# Altium project Soldeerbout_V2.PrjPcb
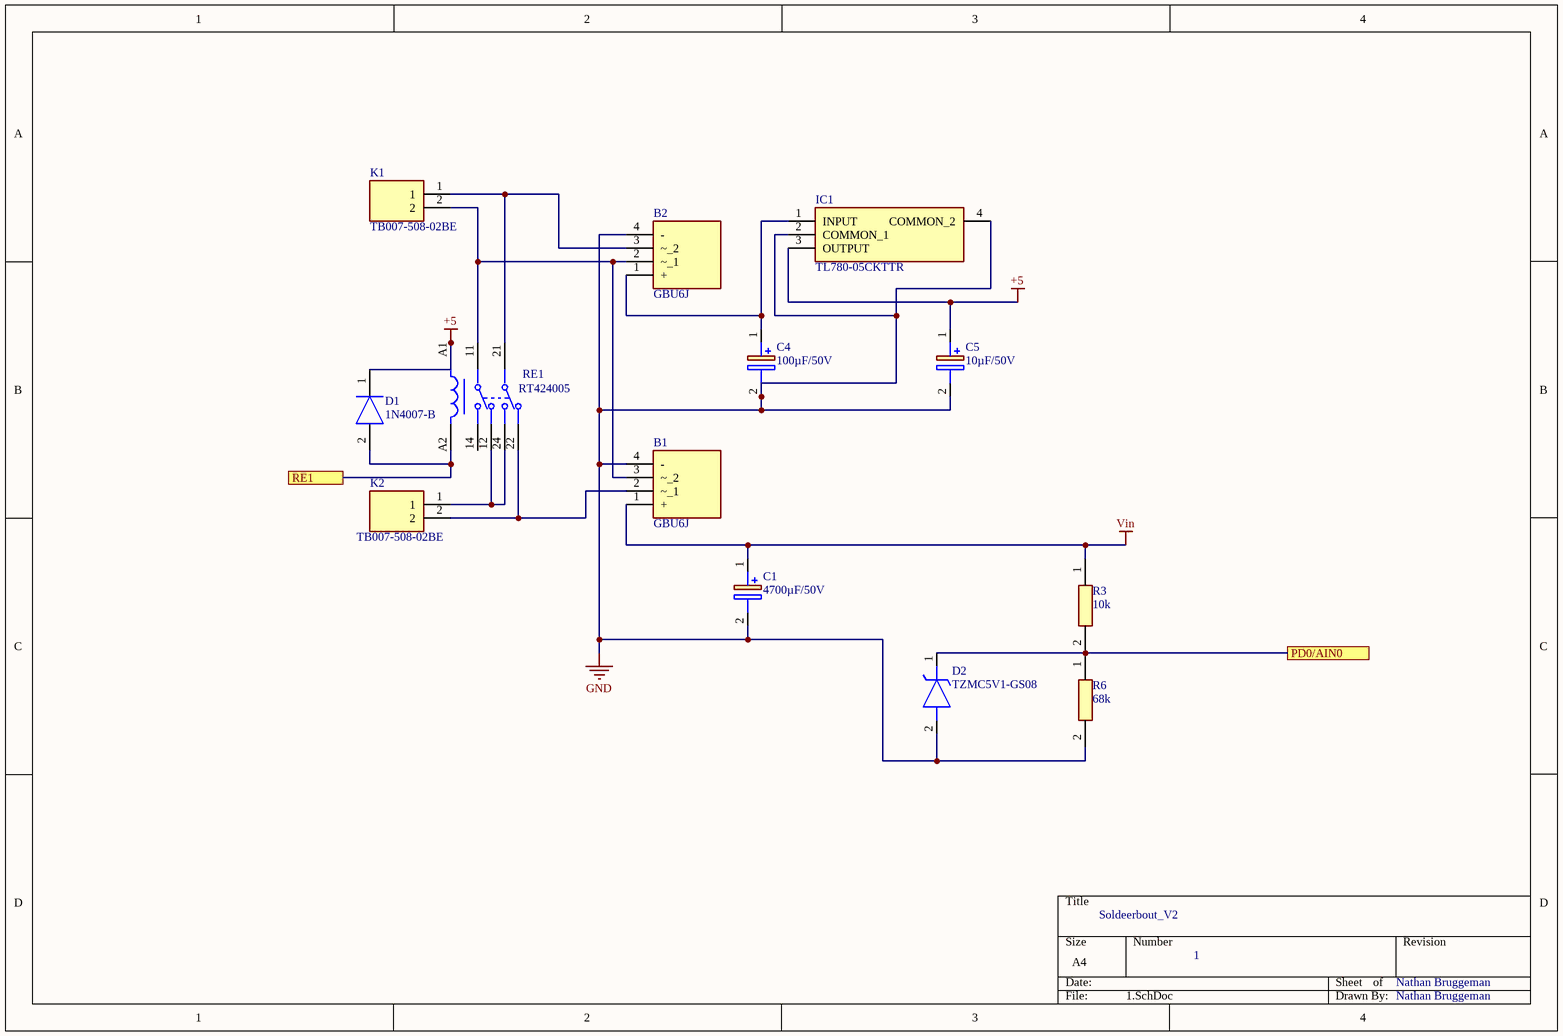
[diagram p0: 1.SchDoc]
4 sheets, 55 parts. Net scope: flat (ports and power ports of the same name join across sheets).
Board file: PCB1.PcbDoc
Sheets:
  1.SchDoc
  2.SchDoc
  3.SchDoc
  6.SchDoc

## Sheet 1.SchDoc
size A4; SheetNumber: 1; SheetTotal: 5

### Parts
B1  GBU6J  [GBU6J]
B2  GBU6J  [GBU6J]
C1  4700µF/50V  [CAPPRD1000W80D2200H3700]
C4  100µF/50V  [CAPPRD350W60D800H1250]
C5  10µF/50V  [CAPPRD200W55D500H1200]
D1  1N4007-B  [DIOAD1410W90L470D235]
D2  TZMC5V1-GS08  [TZMC5V1GS08]
IC1  TL780-05CKTTR  [TL78005CKTTR]
K1  TB007-508-02BE  [TB00750802BE]
K2  TB007-508-02BE  [TB00750802BE]
R3  10k  [0805]
R6  68k  [0805]
RE1  RT424005  [FP-RT424005-MFG]

### Ports
PD0/AIN0, RE1

### Nets
+5: C5.1(+) D1.1(K) IC1.3(OUTPUT) RE1.A1
GND: B1.4(-) B2.4(-) C1.2(-) C4.2(-) C5.2(-) D2.2(A) IC1.2(COMMON_1) IC1.4(COMMON_2) R6.2
Vin: B1.1(+) C1.1(+) R3.1
NetB1_2: B1.2(~_1) K2.2 RE1.22
NetB1_3: B1.3(~_2) B2.2(~_1) K1.2 RE1.11
NetB2_1: B2.1(+) C4.1(+) IC1.1(INPUT)
NetB2_3: B2.3(~_2) K1.1 RE1.21
NetD1_2: D1.2(A) RE1.A2 ; port RE1
NetD2_1: D2.1(K) R3.2 R6.1 ; port PD0/AIN0
NetK2_1: K2.1 RE1.12 RE1.24

Not connected (* = marked no-connect by the designer): RE1 14

### Notes on the sheet
- Soldeerbout_V2
- 1
- Nathan Bruggeman

### Library data of the parts
B1 B2 = GBU6J: Bridge Rectifier; Manufacturer_Name: GeneSiC Semiconductor; Datasheet Link: https://www.diodemodule.com/silicon_products/bridge_rectifiers/gbu6j.pdf; Height: 18.8mm; Manufacturer_Part_Number: GBU6J
C1 = ESK478M050AQ3AA: Capacitor Polarised; Manufacturer_Name: Kemet; Datasheet Link: https://componentsearchengine.com//ESK478M050AQ3AA.pdf; Height: 37mm; Mouser2 Part Number: 80-ESK478M050AQ3AA; Mouser2 Price/Stock: https://www.mouser.com/Search/Refine.aspx?Keyword=80-ESK478M050AQ3AA; Manufacturer_Part_Number: ESK478M050AQ3AA
C4 = ESK107M050AG3EA: Capacitor Polarised; Manufacturer_Name: Kemet; Height: 12.5mm; Manufacturer_Part_Number: ESK107M050AG3EA
C5 = ECA-1HM100: Capacitor Polarised; Manufacturer_Name: Panasonic; Datasheet Link: https://componentsearchengine.com//ECA-1HM100.pdf; Height: 12mm; Mouser2 Part Number: 667-ECA-1HM100; Mouser2 Price/Stock: https://www.mouser.com/Search/Refine.aspx?Keyword=667-ECA-1HM100; Manufacturer_Part_Number: ECA-1HM100
D1 = 1N4007-B: Diode; Manufacturer_Name: Rectron; Datasheet Link: https://www.arrow.com/en/products/1n4007-b/rectron; Manufacturer_Part_Number: 1N4007-B
D2 = TZMC5V1-GS08: Zener Diode; Manufacturer_Name: Vishay; Datasheet Link: https://componentsearchengine.com/Datasheets/2/TZMC5V1-GS08.pdf; Height: 1.6mm; Manufacturer_Part_Number: TZMC5V1-GS08
IC1 = TL780-05CKTTR: Integrated Circuit; Manufacturer_Name: Texas Instruments; Datasheet Link: http://www.ti.com/general/docs/suppproductinfo.tsp?distId=26&gotoUrl=http%3A%2F%2Fwww.ti.com%2Flit%2Fgpn%2Ftl780; Height: 5.08mm; Manufacturer_Part_Number: TL780-05CKTTR
K1 K2 = TB007-508-02BE: Connector; Manufacturer_Name: CUI Inc.; Datasheet Link: https://componentsearchengine.com//TB007-508-02BE.pdf; Height: 14mm; Mouser2 Part Number: 490-TB007-508-02BE; Mouser2 Price/Stock: https://www.mouser.com/Search/Refine.aspx?Keyword=490-TB007-508-02BE; Manufacturer_Part_Number: TB007-508-02BE
R3 R6 = CFN0805-FZ-R030ELF: Resistor; Manufacturer_Name: Bourns; Datasheet Link: https://www.bourns.com/docs/Product-Datasheets/CFN.pdf; Height: 0.9mm; Manufacturer_Part_Number: CFN0805-FZ-R030ELF
RE1 = CMP-03395-000087-1: RELAY GENERAL PURPOSE DPDT 8A 5V; Manufacturer: TE Connectivity; Coil Power: 403mW; Number Of Contacts: 2; Coil Resistance: 62Ω; Coil Type: Non-Latching; Manufacturer Part Number: RT424005; Category: Relay; Octopart: https://octopart.com/5-1393243-9-te+connectivity-41835766; Device Class L3: Power Relays; ComponentLink2URL: https://www.te.com/commerce/DocumentDelivery/DDEController?Action=showdoc&DocId=Data+Sheet%7FRT2%7F1014%7Fpdf%7FEnglish%7FENG_DS_RT2_1014.pdf%7F5-1393243-9; Ambient Temperature Range High: +85°C; ComponentLink2Description: Datasheet; Throw Configuration: DPDT; Digikey Description: RELAY GENERAL PURPOSE DPDT 8A 5V; Package: RT424005; Automotive: No; Device Class L1: Electromechanical; Height: 15.7mm; Device Class L2: Relays; Ambient Temperature Range Low: -40°C; Coil Voltage: 5V; Current Rating: 8A; Mouser Description: General Purpose Relay, Rt2 Series, Power, Non Latching, Dpdt, 5 Vdc, 8 A Rohs Compliant: Yes; Lead Free: Yes; RoHS: TRUE

## Sheet 2.SchDoc
size A4; SheetNumber: 2; SheetTotal: 5
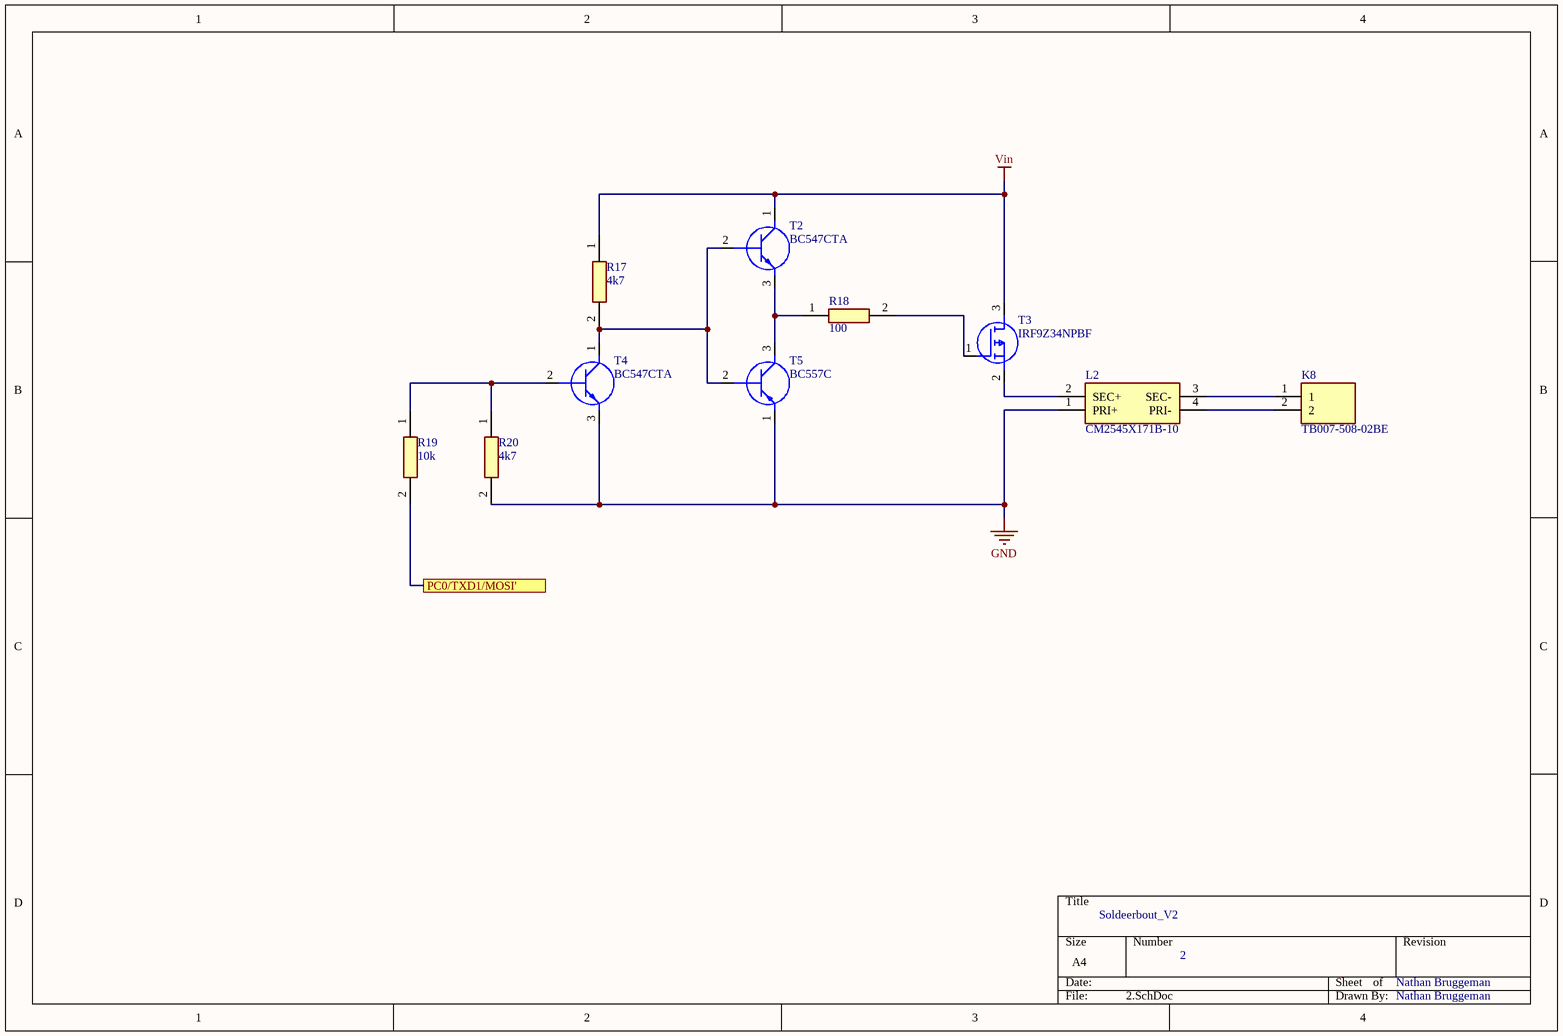
[diagram p1: 2.SchDoc]

### Parts
K8  TB007-508-02BE  [TB00750802BE]
L2  CM2545X171B-10  [CM2545X171B10]
R17  4k7  [0805]
R18  100  [0805]
R19  10k  [0805]
R20  4k7  [0805]
T2  BC547CTA  [BC557C]
T3  IRF9Z34NPBF  [TO254P469X1042X1967-3P]
T4  BC547CTA  [BC557C]
T5  BC557C  [BC557C]

### Ports
PC0/TXD1/MOSI'

### Nets
GND: L2.1(PRI+) R20.2 T4.3(E) T5.1(E)
Vin: R17.1 T2.1(C) T3.3(D)
NetIC3_1: R19.2 ; port PC0/TXD1/MOSI'
NetK8_1: K8.1 L2.3(SEC-)
NetK8_2: K8.2 L2.4(PRI-)
NetL2_2: L2.2(SEC+) T3.2(S)
NetR17_2: R17.2 T2.2(B) T4.1(C) T5.2(B)
NetR18_1: R18.1 T2.3(E) T5.3(C)
NetR18_2: R18.2 T3.1(G)
NetR19_1: R19.1 R20.1 T4.2(B)

### Notes on the sheet
- Soldeerbout_V2
- 2
- Nathan Bruggeman

### Library data of the parts
K8 = TB007-508-02BE: Connector; Manufacturer_Name: CUI Inc.; Datasheet Link: https://componentsearchengine.com//TB007-508-02BE.pdf; Height: 14mm; Mouser2 Part Number: 490-TB007-508-02BE; Mouser2 Price/Stock: https://www.mouser.com/Search/Refine.aspx?Keyword=490-TB007-508-02BE; Manufacturer_Part_Number: TB007-508-02BE
L2 = CM2545X171B-10: Transformer; Manufacturer_Name: Laird Technologies; Datasheet Link: https://datasheet.datasheetarchive.com/originals/dk/DKDS-7/122753.pdf; Height: 9.5mm; Manufacturer_Part_Number: CM2545X171B-10
R17-R20 = CFN0805-FZ-R030ELF: Resistor; Manufacturer_Name: Bourns; Datasheet Link: https://www.bourns.com/docs/Product-Datasheets/CFN.pdf; Height: 0.9mm; Manufacturer_Part_Number: CFN0805-FZ-R030ELF
T2 T4 = BC547CTA: Transistor BJT NPN; Manufacturer_Name: ON Semiconductor; Datasheet Link: http://www.onsemi.com/pub/Collateral/BC550-D.pdf; Manufacturer_Part_Number: BC547CTA
T3 = IRF9Z34NPBF: MOSFET (P-Channel); Manufacturer_Name: Infineon; Datasheet Link: https://componentsearchengine.com//IRF9Z34NPBF.pdf; Height: 4.69mm; Mouser2 Part Number: 942-IRF9Z34NPBF; Mouser2 Price/Stock: https://www.mouser.com/Search/Refine.aspx?Keyword=942-IRF9Z34NPBF; Manufacturer_Part_Number: IRF9Z34NPBF
T5 = BC557C: Transistor BJT PNP; Manufacturer_Name: NXP; Height: 5.2mm; Manufacturer_Part_Number: BC557C

## Sheet 3.SchDoc
size A4; SheetNumber: 3; SheetTotal: 5
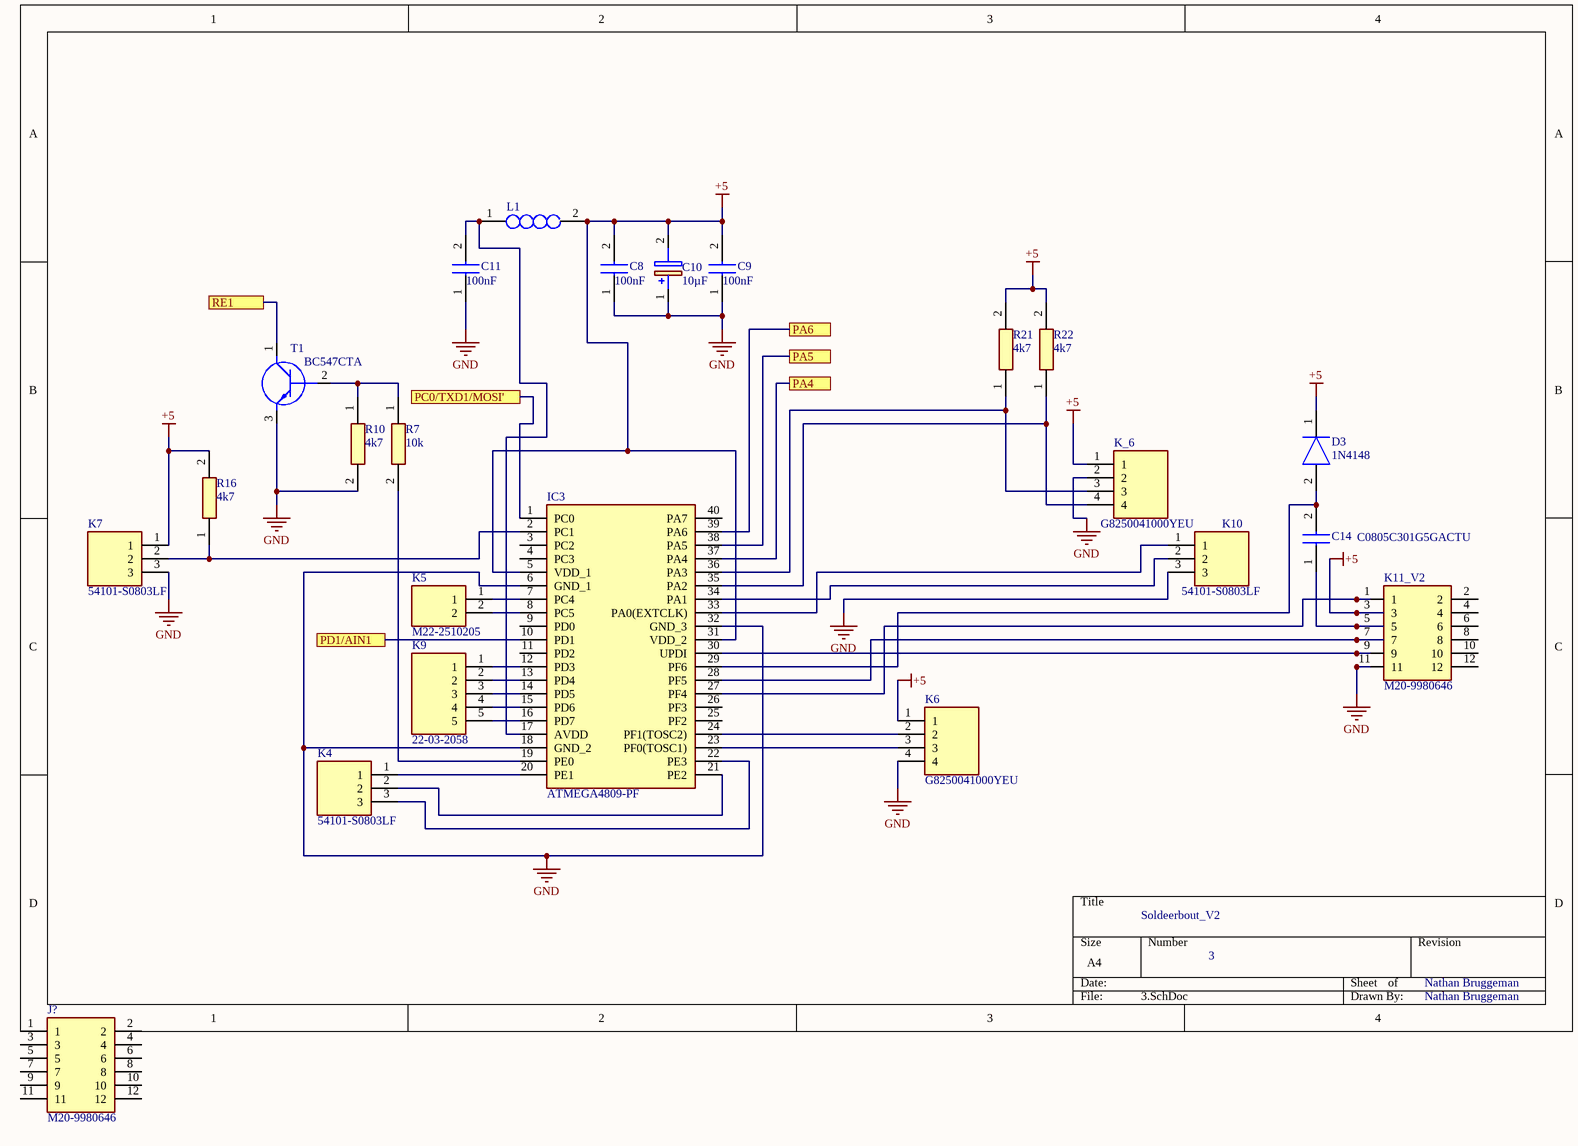
[diagram p2: 3.SchDoc]

### Parts
C8  100nF  [0805]
C9  100nF  [0805]
C10  10µF  [CAPPRD200W55D500H1200]
C11  100nF  [0805]
C14  C0805C301G5GACTU  [0805]
D3  1N4148  [DIOAD1165W56L425D185]
IC3  ATMEGA4809-PF  [DIP1543W58P254L5175H635Q40N]
J?  M20-9980646  [HDRV12W64P254_2X6_1524X508X868P]
K4  54101-S0803LF  [54101S0803LF]
K5  M22-2510205  [HDRV2W60P0X200_1X2_400X200X525P]
K6  G8250041000YEU  [G8250041000YEU]
K7  54101-S0803LF  [54101S0803LF]
K9  22-03-2058  [HDRV5W67P0X254_1X5_1245X236X2068P]
K10  54101-S0803LF  [54101S0803LF]
K11_V2  M20-9980646  [HDRV12W64P254_2X6_1524X508X868P]
K_6  G8250041000YEU  [G8250041000YEU]
L1  LS6045EX-100M-H  [VLS6045]  (value not drawn)
R7  10k  [0805]
R10  4k7  [0805]
R16  4k7  [0805]
R21  4k7  [0805]
R22  4k7  [0805]
T1  BC547CTA  [BC557C]

### Ports
PA4, PA5, PA6, PC0/TXD1/MOSI', PD1/AIN1, RE1

### Nets
+5: C8.2 C9.2 C10.2(-) D3.1(K) IC3.5(VDD_1) IC3.31(VDD_2) K6.1 K7.1 K11_V2.3 K_6.1 L1.2 R16.2 R21.2 R22.2
GND: C8.1 C9.1 C10.1(+) C11.1 IC3.6(GND_1) IC3.18(GND_2) IC3.32(GND_3) K6.4 K7.3 K10.3 K11_V2.11 K_6.2 R10.2 T1.3(E)
NetC3_3_1: IC3.38(PA5) ; port PA5
NetC4_4_1: IC3.39(PA6) ; port PA6
NetC5_5_1: IC3.37(PA4) ; port PA4
NetC11_2: C11.2 IC3.17(AVDD) L1.1
NetC14_1: C14.1 K11_V2.5
NetC14_2: C14.2 D3.2(A) IC3.29(PF6)
NetD1_2: T1.1(C) ; port RE1
NetIC3_1: IC3.1(PC0) ; port PC0/TXD1/MOSI'
NetIC3_2: IC3.2(PC1) K7.2 R16.1
NetIC3_7: IC3.7(PC4) K5.1
NetIC3_8: IC3.8(PC5) K5.2
NetIC3_10: IC3.10(PD1) ; port PD1/AIN1
NetIC3_12: IC3.12(PD3) K9.1
NetIC3_13: IC3.13(PD4) K9.2
NetIC3_14: IC3.14(PD5) K9.3
NetIC3_15: IC3.15(PD6) K9.4
NetIC3_16: IC3.16(PD7) K9.5
NetIC3_19: IC3.19(PE0) R7.2
NetIC3_20: IC3.20(PE1) K4.1
NetIC3_21: IC3.21(PE2) K4.2
NetIC3_22: IC3.22(PE3) K4.3
NetIC3_23: IC3.23(PF0(TOSC1)) K6.3
NetIC3_24: IC3.24(PF1(TOSC2)) K6.2
NetIC3_27: IC3.27(PF4) K11_V2.1
NetIC3_28: IC3.28(PF5) K11_V2.7
NetIC3_30: IC3.30(UPDI) K11_V2.9
NetIC3_33: IC3.33(PA0(EXTCLK)) K10.1
NetIC3_34: IC3.34(PA1) K10.2
NetIC3_35: IC3.35(PA2) K_6.4 R22.1
NetIC3_36: IC3.36(PA3) K_6.3 R21.1
NetR7_1: R7.1 R10.1 T1.2(B)

Not connected (* = marked no-connect by the designer): IC3 3(PC2) 4(PC3) 9(PD0) 11(PD2) 25(PF2) 26(PF3) 40(PA7); J? 1 2 3 4 5 6 7 8 9 10 11 12; K11_V2 2 4 6 8 10 12

### Notes on the sheet
- Soldeerbout_V2
- 3
- Nathan Bruggeman

### Library data of the parts
C8 C9 C11 C14 = C0805C301G5GACTU: Capacitor; Manufacturer_Name: Kemet; Datasheet Link: https://connect.kemet.com:7667/gateway/IntelliData-ComponentDocumentation/1.0/download/specsheet/C0805C301G5GACTU; Height: 0.88mm; Manufacturer_Part_Number: C0805C301G5GACTU
C10 = ECA-1HM100: as C5 on sheet 1; Datasheet Link: https://componentsearchengine.com//ECA-1HM100.pdf; Height: 12mm; Mouser2 Part Number: 667-ECA-1HM100; Mouser2 Price/Stock: https://www.mouser.com/Search/Refine.aspx?Keyword=667-ECA-1HM100; Manufacturer_Part_Number: ECA-1HM100
D3 = 1N4148: Diode; Manufacturer_Name: Nexperia; Datasheet Link: https://datasheet.datasheetarchive.com/originals/distributors/Datasheets-112/DSAP0040891.pdf; Manufacturer_Part_Number: 1N4148
IC3 = ATMEGA4809-PF: Integrated Circuit; Manufacturer_Name: Microchip; Datasheet Link: https://componentsearchengine.com//ATMEGA4809-PF.pdf; Height: 6.35mm; Mouser2 Part Number: 556-ATMEGA4809-PF; Mouser2 Price/Stock: https://www.mouser.com/Search/Refine.aspx?Keyword=556-ATMEGA4809-PF; Manufacturer_Part_Number: ATMEGA4809-PF
J? = M20-9980646: Connector; Manufacturer_Name: Harwin; Height: 8.68mm; Manufacturer_Part_Number: M20-9980646
K4 K7 K10 = 54101-S0803LF: Connector; Manufacturer_Name: Amphenol; Datasheet Link: https://cdn.amphenol-icc.com/media/wysiwyg/files/drawing/54101.pdf; Height: 8.58mm; Manufacturer_Part_Number: 54101-S0803LF
K5 = M22-2510205: Connector; Manufacturer_Name: Harwin; Datasheet Link: https://cdn.harwin.com/pdfs/M22-251.pdf; Height: 5.25mm; Manufacturer_Part_Number: M22-2510205
K6 K_6 = G8250041000YEU: Connector; Manufacturer_Name: Amphenol; Datasheet Link: https://cdn.amphenol-icc.com/media/wysiwyg/files/drawing/g825xxx10x0yeu.pdf; Height: 6.35mm; Manufacturer_Part_Number: G8250041000YEU
K9 = 22-03-2058: Capacitor; Manufacturer_Name: Molex; Height: 20.68mm; Manufacturer_Part_Number: 22-03-2058
K11_V2 = M20-9980646: Connector; Manufacturer_Name: Harwin; Description: 06+06 DIL Vertical Pin Header HARWIN M20 Series; Height: 8.68mm; Manufacturer_Part_Number: M20-9980646
L1 = VLS6045EX-100M-H: Inductor; Manufacturer_Name: TDK; Datasheet Link: https://componentsearchengine.com//VLS6045EX-100M-H.pdf; Mouser2 Part Number: 810-VLS6045EX-100M-H; Mouser2 Price/Stock: https://www.mouser.com/Search/Refine.aspx?Keyword=810-VLS6045EX-100M-H; Manufacturer_Part_Number: VLS6045EX-100M-H
R7 R10 R16 R21 R22 = CFN0805-FZ-R030ELF: Resistor; Manufacturer_Name: Bourns; Datasheet Link: https://www.bourns.com/docs/Product-Datasheets/CFN.pdf; Height: 0.9mm; Manufacturer_Part_Number: CFN0805-FZ-R030ELF
T1 = BC547CTA: as T2 on sheet 2; Datasheet Link: http://www.onsemi.com/pub/Collateral/BC550-D.pdf; Manufacturer_Part_Number: BC547CTA

## Sheet 6.SchDoc
size A4; SheetNumber: 5; SheetTotal: 5
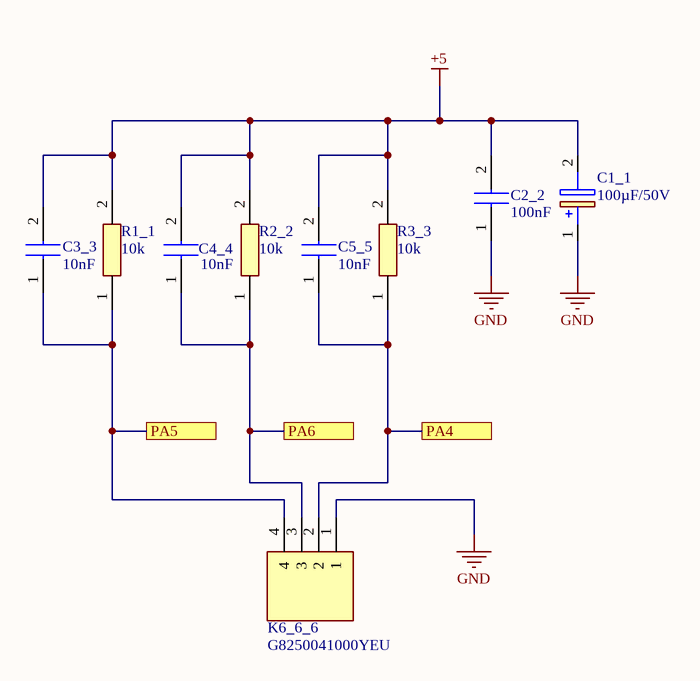
[diagram p3: 6.SchDoc]

### Parts
C1_1  100µF/50V  [CAPPRD350W60D800H1250]
C2_2  100nF  [0805]
C3_3  10nF  [0805]
C4_4  10nF  [0805]
C5_5  10nF  [0805]
K6_6_6  G8250041000YEU  [G8250041000YEU]
R1_1  10k  [0805]
R2_2  10k  [0805]
R3_3  10k  [0805]

### Ports
PA4, PA5, PA6

### Nets
+5: C1_1.2(-) C2_2.2 C3_3.2 C4_4.2 C5_5.2 R1_1.2 R2_2.2 R3_3.2
GND: C1_1.1(+) C2_2.1 K6_6_6.1
NetC3_3_1: C3_3.1 K6_6_6.4 R1_1.1 ; port PA5
NetC4_4_1: C4_4.1 K6_6_6.3 R2_2.1 ; port PA6
NetC5_5_1: C5_5.1 K6_6_6.2 R3_3.1 ; port PA4

### Library data of the parts
C1_1 = ESK107M050AG3EA: as C4 on sheet 1; Height: 12.5mm; Manufacturer_Part_Number: ESK107M050AG3EA
C2_2 C3_3 C4_4 C5_5 = C0805C301G5GACTU: Capacitor; Manufacturer_Name: Kemet; Datasheet Link: https://connect.kemet.com:7667/gateway/IntelliData-ComponentDocumentation/1.0/download/specsheet/C0805C301G5GACTU; Height: 0.88mm; Manufacturer_Part_Number: C0805C301G5GACTU
K6_6_6 = G8250041000YEU: Connector; Manufacturer_Name: Amphenol; Datasheet Link: https://cdn.amphenol-icc.com/media/wysiwyg/files/drawing/g825xxx10x0yeu.pdf; Height: 6.35mm; Manufacturer_Part_Number: G8250041000YEU
R1_1 R2_2 R3_3 = CFN0805-FZ-R030ELF: Resistor; Manufacturer_Name: Bourns; Datasheet Link: https://www.bourns.com/docs/Product-Datasheets/CFN.pdf; Height: 0.9mm; Manufacturer_Part_Number: CFN0805-FZ-R030ELF

## Nets that join several sheets
+5: 1 (C5.1 D1.1 IC1.3 RE1.A1), 3 (14 pins), 6 (8 pins)
GND: 1 (9 pins), 2 (L2.1 R20.2 T4.3 T5.1), 3 (14 pins), 6 (C1_1.1 C2_2.1 K6_6_6.1)
Vin: 1 (B1.1 C1.1 R3.1), 2 (R17.1 T2.1 T3.3)
NetC3_3_1: 3 (IC3.38), 6 (C3_3.1 K6_6_6.4 R1_1.1)
NetC4_4_1: 3 (IC3.39), 6 (C4_4.1 K6_6_6.3 R2_2.1)
NetC5_5_1: 3 (IC3.37), 6 (C5_5.1 K6_6_6.2 R3_3.1)
NetD1_2: 1 (D1.2 RE1.A2), 3 (T1.1)
NetIC3_1: 2 (R19.2), 3 (IC3.1)